# EAGLE design eTapper1main25 (EAGLE 8.2.2)
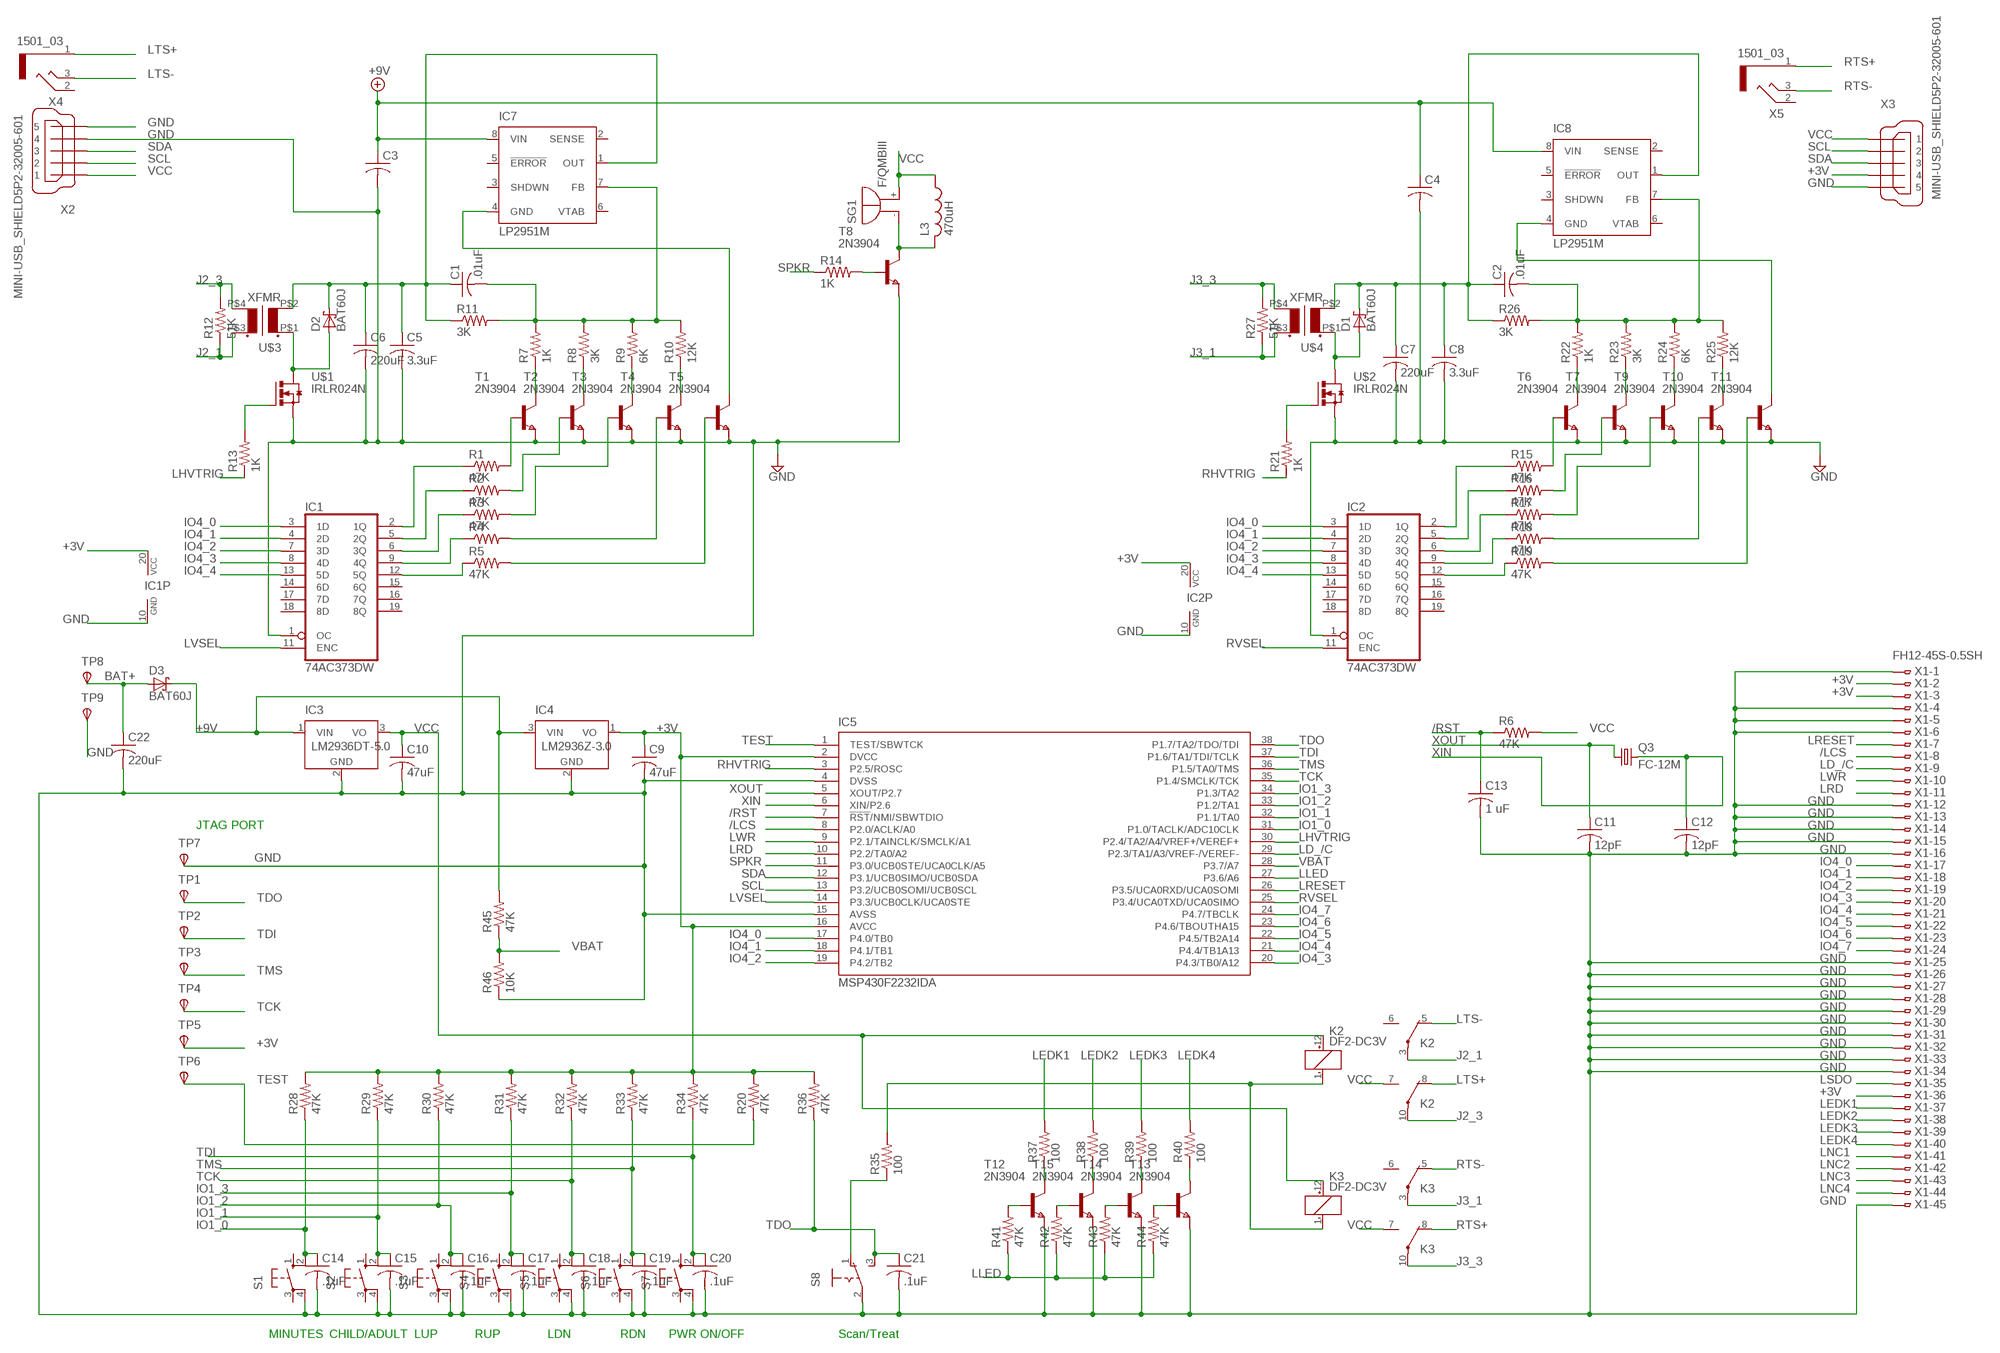
[diagram p0: schematic, sheet 1]

## Parts
C1  .01uF  C-USC0805  [C0805]
C2  .01uF  C-USC0805  [C0805]
C3  C-USC0805  [C0805]
C4  C-USC0805  [C0805]
C5  3.3uF  C-USC0805  [C0805]
C6  220uF  C-USC0805  [C0805]
C7  220uF  C-USC0805  [C0805]
C8  3.3uF  C-USC0805  [C0805]
C9  47uF  C-USC0805  [C0805]
C10  47uF  C-USC0805  [C0805]
C11  12pF  C-USC0805  [C0805]
C12  12pF  C-USC0805  [C0805]
C13  1 uF  C-USC0805  [C0805]
C14  .1uF  C-USC0805  [C0805]
C15  .1uF  C-USC0805  [C0805]
C16  .1uF  C-USC0805  [C0805]
C17  .1uF  C-USC0805  [C0805]
C18  .1uF  C-USC0805  [C0805]
C19  .1uF  C-USC0805  [C0805]
C20  .1uF  C-USC0805  [C0805]
C21  .1uF  C-USC0805  [C0805]
C22  220uF  C-USC0805  [C0805]
D1  BAT60J  [SOD323_ST]
D2  BAT60J  [SOD323_ST]
D3  BAT60J  [SOD323_ST]
IC1  74AC373DW  [SO20W]
IC2  74AC373DW  [SO20W]
IC3  LM2936DT-5.0  [TO252]
IC4  LM2936Z-3.0  [TO92]
IC5  MSP430F2232IDA  [TSSOP38_R-PDSO-G38-DA]
IC7  LP2951M  [SO08]
IC8  LP2951M  [SO08]
K2  DF2-DC3V  [DF2]
K3  DF2-DC3V  [DF2]
L3  470uH  L-USL2825P  [L2825P]
Q3  FC-12M  [FC-12M]
R1  47K  R-US_R0402  [R0402]
R2  47K  R-US_R0402  [R0402]
R3  47K  R-US_R0402  [R0402]
R4  R-US_R0402  [R0402]
R5  47K  R-US_R0402  [R0402]
R6  47K  R-US_R0402  [R0402]
R7  1K  R-US_R0402  [R0402]
R8  3K  R-US_R0402  [R0402]
R9  6K  R-US_R0402  [R0402]
R10  12K  R-US_R0402  [R0402]
R11  3K  R-US_R0402  [R0402]
R12  51K  R-US_R0402  [R0402]
R13  1K  R-US_R0402  [R0402]
R14  1K  R-US_R0402  [R0402]
R15  47K  R-US_R0402  [R0402]
R16  47K  R-US_R0402  [R0402]
R17  47K  R-US_R0402  [R0402]
R18  47K  R-US_R0402  [R0402]
R19  47K  R-US_R0402  [R0402]
R20  47K  R-US_R0402  [R0402]
R21  1K  R-US_R0402  [R0402]
R22  1K  R-US_R0402  [R0402]
R23  3K  R-US_R0402  [R0402]
R24  6K  R-US_R0402  [R0402]
R25  12K  R-US_R0402  [R0402]
R26  3K  R-US_R0402  [R0402]
R27  51K  R-US_R0402  [R0402]
R28  47K  R-US_R0402  [R0402]
R29  47K  R-US_R0402  [R0402]
R30  47K  R-US_R0402  [R0402]
R31  47K  R-US_R0402  [R0402]
R32  47K  R-US_R0402  [R0402]
R33  47K  R-US_R0402  [R0402]
R34  47K  R-US_R0402  [R0402]
R35  100  R-US_R0402  [R0402]
R36  47K  R-US_R0402  [R0402]
R37  100  R-US_R0402  [R0402]
R38  100  R-US_R0402  [R0402]
R39  100  R-US_R0402  [R0402]
R40  100  R-US_R0402  [R0402]
R41  47K  R-US_R0402  [R0402]
R42  47K  R-US_R0402  [R0402]
R43  47K  R-US_R0402  [R0402]
R44  47K  R-US_R0402  [R0402]
R45  47K  R-US_R0402  [R0402]
R46  10K  R-US_R0402  [R0402]
S1  10-XX  [B3F-10XX]
S2  10-XX  [B3F-10XX]
S3  10-XX  [B3F-10XX]
S4  10-XX  [B3F-10XX]
S5  10-XX  [B3F-10XX]
S6  10-XX  [B3F-10XX]
S7  10-XX  [B3F-10XX]
S8  M251  [M251]
SG1  F/QMBIII  [F/QMBIII]
T1  2N3904  NPNSOT23  [SOT-23]
T2  2N3904  NPNSOT23  [SOT-23]
T3  2N3904  NPNSOT23  [SOT-23]
T4  2N3904  NPNSOT23  [SOT-23]
T5  2N3904  NPNSOT23  [SOT-23]
T6  2N3904  NPNSOT23  [SOT-23]
T7  2N3904  NPNSOT23  [SOT-23]
T8  2N3904  NPNSOT23  [SOT-23]
T9  2N3904  NPNSOT23  [SOT-23]
T10  2N3904  NPNSOT23  [SOT-23]
T11  2N3904  NPNSOT23  [SOT-23]
T12  2N3904  NPNSOT23  [SOT-23]
T13  2N3904  NPNSOT23  [SOT-23]
T14  2N3904  NPNSOT23  [SOT-23]
T15  2N3904  NPNSOT23  [SOT-23]
TP1  TPSTP06R  [TP06R]
TP2  TPSTP06R  [TP06R]
TP3  TPSTP06R  [TP06R]
TP4  TPSTP06R  [TP06R]
TP5  TPSTP06R  [TP06R]
TP6  TPSTP06R  [TP06R]
TP7  TPSTP06R  [TP06R]
TP8  TPSTP06R  [TP06R]
TP9  TPSTP06R  [TP06R]
U$1  IRLR024N  [D-PAK_TO252AA]
U$2  IRLR024N  [D-PAK_TO252AA]
U$3  XFMR  [XFMR]
U$4  XFMR  [XFMR]
X1  FH12-45S-0.5SH  [FH12-45S-0.5SH]
X2  MINI-USB_SHIELD5P2-32005-601  [32005-601]
X3  MINI-USB_SHIELD5P2-32005-601  [32005-601]
X4  1501_03  [1501_03]
X5  1501_03  [1501_03]

## Nets
+3V: C9.1 IC1.20(VCC) IC2.20(VCC) IC4.1(VO) IC5.2(DVCC) IC5.16(AVCC) R20.2 R28.2 R29.2 R30.2 R31.2 R32.2 R33.2 R34.2 R36.2 TP5.TP(PP) X1.2 X1.3 X1.36 X3.4
+9V: C3.1 C4.1 D3.C IC3.1(VIN) IC4.3(VIN) IC7.8(VIN) IC8.8(VIN) R45.2
/LCS: IC5.8(P2.0/ACLK/A0) X1.8
/RST: C13.1 IC5.7(!RST!/NMI/SBWTDIO) R6.1
BAT+: C22.1 D3.A TP8.TP(PP)
GND: C3.2 C4.2 C5.2 C6.2 C7.2 C8.2 C9.2 C10.2 C11.2 C12.2 C13.2 C14.2 C15.2 C16.2 C17.2 C18.2 C19.2 C20.2 C21.2 C22.2 IC1.1(OC) IC1.10(GND) IC2.1(OC) IC2.10(GND) IC3.2(GND) IC4.2(GND) IC5.4(DVSS) IC5.15(AVSS) R46.1 S1.4(P1) S2.4(P1) S3.4(P1) S4.4(P1) S5.4(P1) S6.4(P1) S7.4(P1) S8.2(P) T1.2(E) T2.2(E) T3.2(E) T4.2(E) T5.2(E) T6.2(E) T7.2(E) T8.2(E) T9.2(E) T10.2(E) T11.2(E) T12.2(E) T13.2(E) T14.2(E) T15.2(E) TP7.TP(PP) TP9.TP(PP) U$1.3(S) U$2.3(S) X1.1 X1.4 X1.5 X1.6 X1.12 X1.13 X1.14 X1.15 X1.16 X1.25 X1.26 X1.27 X1.28 X1.29 X1.30 X1.31 X1.32 X1.33 X1.34 X1.45 X2.4 X2.5 X3.5
IO1_0: C14.1 IC5.31(P1.0/TACLK/ADC10CLK) R28.1 S1.2(S1)
IO1_1: C15.1 IC5.32(P1.1/TA0) R29.1 S2.2(S1)
IO1_2: C16.1 IC5.33(P1.2/TA1) R30.1 S3.2(S1)
IO1_3: C17.1 IC5.34(P1.3/TA2) R31.1 S4.2(S1)
IO4_0: IC1.3(1D) IC2.3(1D) IC5.17(P4.0/TB0) X1.17
IO4_1: IC1.4(2D) IC2.4(2D) IC5.18(P4.1/TB1) X1.18
IO4_2: IC1.7(3D) IC2.7(3D) IC5.19(P4.2/TB2) X1.19
IO4_3: IC1.8(4D) IC2.8(4D) IC5.20(P4.3/TB0/A12) X1.20
IO4_4: IC1.13(5D) IC2.13(5D) IC5.21(P4.4/TB1A13) X1.21
IO4_5: IC5.22(P4.5/TB2A14) X1.22
IO4_6: IC5.23(P4.6/TBOUTHA15) X1.23
IO4_7: IC5.24(P4.7/TBCLK) X1.24
J2_1: K2.3(2:P) R12.1 U$3.P$3(S1)
J2_3: K2.10(3:P) R12.2 U$3.P$4(S2)
J3_1: K3.3(2:P) R27.1 U$4.P$3(S1)
J3_3: K3.10(3:P) R27.2 U$4.P$4(S2)
LD_/C: IC5.29(P2.3/TA1/A3/VREF-/VEREF-) X1.9
LEDK1: R37.2 X1.37
LEDK2: R38.2 X1.38
LEDK3: R39.2 X1.39
LEDK4: R40.2 X1.40
LHVTRIG: IC5.30(P2.4/TA2/A4/VREF+/VEREF+) R13.1
LLED: IC5.27(P3.6/A6) R41.1 R42.1 R43.1 R44.1
LNC1: X1.41
LNC2: X1.42
LNC3: X1.43
LNC4: X1.44
LRD: IC5.10(P2.2/TA0/A2) X1.11
LRESET: IC5.26(P3.5/UCA0RXD/UCA0SOMI) X1.7
LSDO: X1.35
LTS+: K2.8(3:O) X4.1
LTS-: K2.5(2:O) X4.3
LVSEL: IC1.11(ENC) IC5.14(P3.3/UCB0CLK/UCA0STE)
LWR: IC5.9(P2.1/TAINCLK/SMCLK/A1) X1.10
N$1: IC1.2(1Q) R1.1
N$2: IC1.5(2Q) R2.1
N$3: IC1.6(3Q) R3.1
N$4: IC1.9(4Q) R4.1
N$5: IC1.12(5Q) R5.1
N$6: L3.2 SG1.-(+) T8.1(C)
N$7: R4.2 T4.3(B)
N$8: R5.2 T5.3(B)
N$9: D2.A U$1.4(D) U$3.P$1(P1)
N$10: R7.1 T1.1(C)
N$11: R8.1 T2.1(C)
N$12: R9.1 T3.1(C)
N$13: R1.2 T1.3(B)
N$14: R2.2 T2.3(B)
N$15: R3.2 T3.3(B)
N$16: R10.1 T4.1(C)
N$17: C1.2 IC7.7(FB) R7.2 R8.2 R9.2 R10.2 R11.2
N$18: C1.1 C5.1 C6.1 D2.C IC7.1(OUT) R11.1 U$3.P$2(P2)
N$19: D1.A U$2.4(D) U$4.P$1(P1)
N$20: IC2.2(1Q) R15.1
N$21: R13.2 U$1.1(G)
N$22: R14.2 T8.3(B)
N$23: R35.1 S8.1(O)
N$24: IC2.5(2Q) R16.1
N$25: IC2.6(3Q) R17.1
N$26: IC2.9(4Q) R18.1
N$27: IC2.12(5Q) R19.1
N$28: R44.2 T13.3(B)
N$29: R15.2 T6.3(B)
N$30: R16.2 T7.3(B)
N$31: R17.2 T9.3(B)
N$32: R18.2 T10.3(B)
N$33: R19.2 T11.3(B)
N$34: K2.1(1:-) K3.1(1:-) R35.2
N$35: R22.1 T6.1(C)
N$36: R23.1 T7.1(C)
N$37: R24.1 T9.1(C)
N$38: R25.1 T10.1(C)
N$39: C2.2 IC8.7(FB) R22.2 R23.2 R24.2 R25.2 R26.2
N$40: C2.1 C7.1 C8.1 D1.C IC8.1(OUT) R26.1 U$4.P$2(P2)
N$41: R37.1 T12.1(C)
N$42: R21.2 U$2.1(G)
N$43: R38.1 T15.1(C)
N$44: R39.1 T14.1(C)
N$45: IC7.4(GND) T5.1(C)
N$46: R40.1 T13.1(C)
N$47: IC8.4(GND) T11.1(C)
N$48: R43.2 T14.3(B)
N$49: R41.2 T12.3(B)
N$50: R42.2 T15.3(B)
RHVTRIG: IC5.3(P2.5/ROSC) R21.1
RTS+: K3.8(3:O) X5.1
RTS-: K3.5(2:O) X5.3
RVSEL: IC2.11(ENC) IC5.25(P3.4/UCA0TXD/UCA0SIMO)
SCL: IC5.13(P3.2/UCB0SOMI/UCB0SCL) X2.2 X3.2
SDA: IC5.12(P3.1/UCB0SIMO/UCB0SDA) X2.3 X3.3
SPKR: IC5.11(P3.0/UCB0STE/UCA0CLK/A5) R14.1
TCK: C18.1 IC5.35(P1.4/SMCLK/TCK) R32.1 S5.2(S1) TP4.TP(PP)
TDI: C20.1 IC5.37(P1.6/TA1/TDI/TCLK) R34.1 S7.2(S1) TP2.TP(PP)
TDO: C21.1 IC5.38(P1.7/TA2/TDO/TDI) R36.1 S8.3(S) TP1.TP(PP)
TEST: IC5.1(TEST/SBWTCK) R20.1 TP6.TP(PP)
TMS: C19.1 IC5.36(P1.5/TA0/TMS) R33.1 S6.2(S1) TP3.TP(PP)
VBAT: IC5.28(P3.7/A7) R45.1 R46.2
VCC: C10.1 IC3.3(VO) K2.7(3:S) K2.12(1:+) K3.7(3:S) K3.12(1:+) L3.1 R6.2 SG1.+(-) X2.1 X3.1
XIN: C12.1 IC5.6(XIN/P2.6) Q3.2
XOUT: C11.1 IC5.5(XOUT/P2.7) Q3.1
Unconnected: IC1.14(6D) IC1.15(6Q) IC1.16(7Q) IC1.17(7D) IC1.18(8D) IC1.19(8Q) IC2.14(6D) IC2.15(6Q) IC2.16(7Q) IC2.17(7D) IC2.18(8D) IC2.19(8Q) IC7.2(SENSE) IC7.3(SHDWN) IC7.5(!ERROR) IC7.6(VTAB) IC8.2(SENSE) IC8.3(SHDWN) IC8.5(!ERROR) IC8.6(VTAB) K2.6(2:S) K3.6(2:S) S1.1(S) S1.3(P) S2.1(S) S2.3(P) S3.1(S) S3.3(P) S4.1(S) S4.3(P) S5.1(S) S5.3(P) S6.1(S) S6.3(P) S7.1(S) S7.3(P) X2.M1(S1) X2.M2(S2) X3.M1(S1) X3.M2(S2) X4.2 X5.2

## Notes on the sheet
- JTAG PORT
- MINUTES | CHILD/ADULT | LUP | RUP | LDN | RDN | PWR ON/OFF | Scan/Treat

## Library data of the parts
C1-C22 = rcl:C-US: CAPACITOR, American symbol
D1-D3 = diode:BAT60J: Schottky barrier diode Source: www.st.com, BAT60J.pdf
IC1 IC2 = 74xx-eu:74*373: Octal D type transparent LATCH, edge triggered
IC3 = national-semiconductor:LM2936?*: Ultra-Low Quiescent Current LDO Voltage Regulator Source: Data sheet <http://www.national.com/ds/LM/LM2936.pdf>; MF: NATIONAL SEMICONDUCTOR; MPN: LM2936DT-5.0/NOPB; OC_FARNELL: 1286864; OC_NEWARK: 41K4501
IC4 = national-semiconductor:LM2936?*: Ultra-Low Quiescent Current LDO Voltage Regulator Source: Data sheet <http://www.national.com/ds/LM/LM2936.pdf>; MF: NATIONAL SEMICONDUCTOR; MPN: LM2936Z-3.0/NOPB; OC_FARNELL: 1312709; OC_NEWARK: 41K4531
IC5 = texas:MSP430F22*2IDA: MIXED SIGNAL MICROCONTROLLER Source: http://focus.ti.com/lit/ds/symlink/msp430f2274.pdf; MPN: MSP430F2232IDA; OC_FARNELL: 1610178; OC_NEWARK: 28M6312
IC7 IC8 = national-semiconductor:LP2951: Adjustable Micropower Voltage Regulator Source: http://www.national.com/ds/LP/LP2950.pdf; MF: FAIRCHILD SEMICONDUCTOR; MPN: LP2951CM; OC_FARNELL: 9488561; OC_NEWARK: 78K6014
K2 K3 = relay:DF2-?DC*: HIGHLY SENSITIVE DIP MINIATURE RELAY NAiS Single side stable / 1 coil latching Source: http://www.mew-europe.com/.. en_ds_61002_0000.pdf; OC_FARNELL: unknown; OC_NEWARK: unknown
L3 = rcl:L-US: INDUCTOR, American symbol
Q3 = crystal:FC-12M: kHz RANGE CRYSTAL UNIT LOW PROFILE SMD Source: Epson Toyocom FC-12M.pdf
R1-R46 = resistor:R-US_: RESISTOR, American symbol
S1-S7 = switch-omron:10-XX: OMRON SWITCH; MPN: B3F-1000; OC_FARNELL: 176432; OC_NEWARK: 36M3542
S8 = switch:M251: SLIDING SWITCH Mors, distributor Buerklin, 11G702
SG1 = buzzer:F/QMBIII: BUZZER Source: Buerklin; OC_FARNELL: unknown; OC_NEWARK: unknown
T1-T15 = zetex:NPNSOT23: NPN TRANSISTOR; MPN: DSS20201L-7; OC_FARNELL: 1710688; OC_NEWARK: 25R4555
TP1-TP9 = testpad:TPS: TEST PIN
U$1 U$2 = IRLR024N:IRLR024N: IRLR024N HEXFET Power Mosfet N channel Infeneon Technology TO-251AA IPAK
U$3 U$4 = XFMR:XFMR: Transformer 1"X1" 0.4"X0.4" hole separation for e_tapper
X1 = con-hirose:FH12-45S-0.5S: 0.5mm Pitch Connectors For FPC/FFC Source: Data sheet <http://www.hirose.co.jp/cataloge_hp/e58605370.pdf>; OC_FARNELL: unknown; OC_NEWARK: unknown
X2 X3 = con-cypressindustries:MINI-USB_SHIELD5P2-: MINI USB-B R/A DIP 5pol. Source: www.cypressindustries.com; OC_FARNELL: unknown; OC_NEWARK: unknown
X4 X5 = con-lumberg:1501_03: Klinkensteckverbinder nach JISC 6560, 2,5 mm Jack connectors according to JISC 6560, 2.5 mm Source: http://www.lumberg.com/Produkte/PDFs/1501_03.pdf; OC_FARNELL: 1200127; OC_NEWARK: unknown

## Module LP2951
Ports: 

### Library data of the parts

## Board
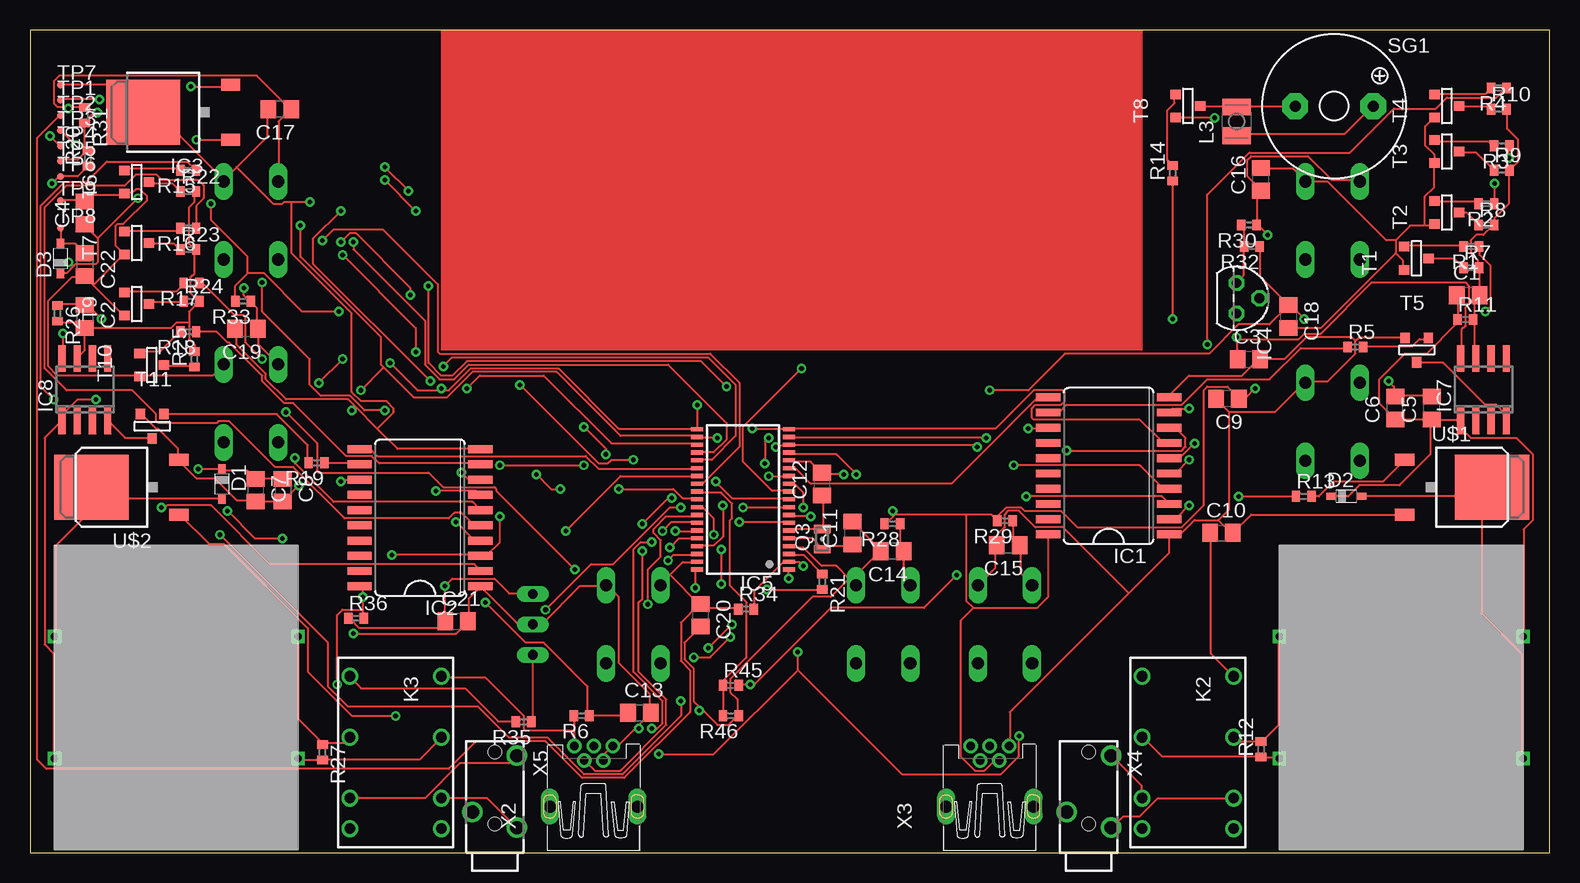
[diagram p1: board, top side]
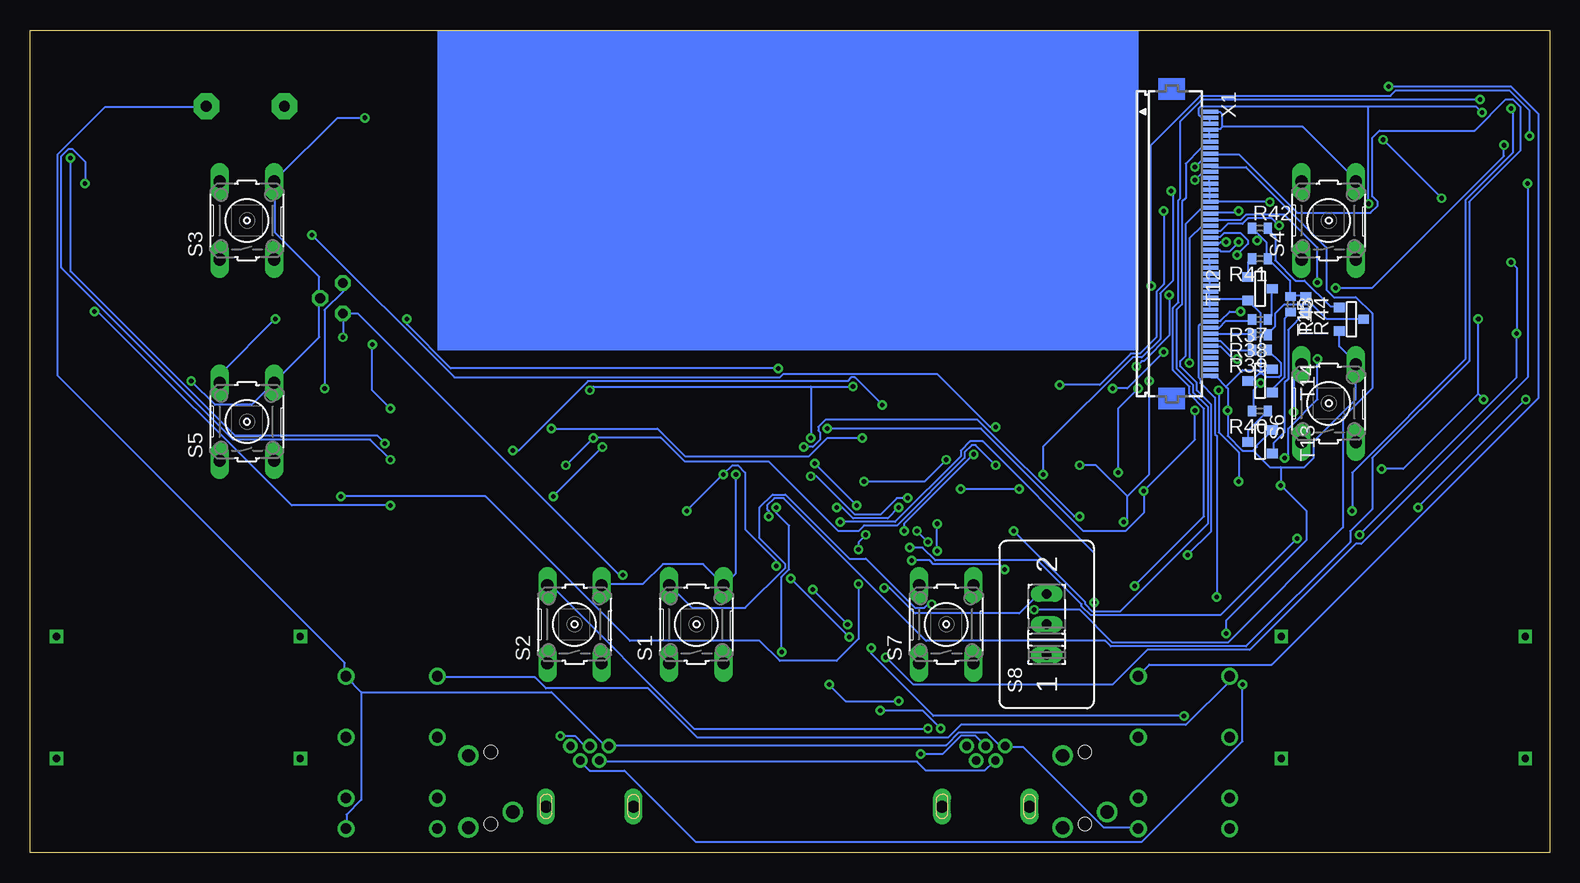
[diagram p2: board, bottom side, seen from below]

Size 126.67 x 68.57 mm. Coordinates in mm from the lower left corner, seen from the top.
Outline: 0,0 126.67,0 126.67,68.57 0,68.57 0,0
Copper layers (1*16): Top 0.035mm / dielectric 1.5mm / Bottom 0.035mm
Design rules "default *": minimum track width 6mil, minimum drill 15mil, track to track 6mil, track to pad 6mil, pad to pad 6mil, via to via 6mil, smd to smd 6mil, copper to edge 10mil, drill to drill 10mil, minimum pad ring 10mil, minimum via ring 8mil, stop-mask expansion 4mil, vias tented up to drill 0mil, thermal gap 15mil

### Footprints (pad centres in the part's own frame; a part is rotated, then mirrored left to right if it is on the bottom)
C0805 = smd 1.3 x 1.5: 1 -0.95,0; 2 0.95,0
SOD323_ST = smd 0.8 x 0.6: A 1.25,0; C -1.25,0
SO20W = smd 0.66 x 2.032: 1 -5.715,-5.029; 2 -4.445,-5.029; 3 -3.175,-5.029; 4 -1.905,-5.029; 5 -0.635,-5.029; 6 0.635,-5.029; 7 1.905,-5.029; 8 3.175,-5.029; 9 4.445,-5.029; 10 5.715,-5.029; 11 5.715,5.029; 12 4.445,5.029; 13 3.175,5.029; 14 1.905,5.029; 15 0.635,5.029; 16 -0.635,5.029; 17 -1.905,5.029; 18 -3.175,5.029; 19 -4.445,5.029; 20 -5.715,5.029
TO252 = smd 1 x 1.6: 1 -2.28,-4.8; 3 2.28,-4.8 | smd 5.4 x 6.2: 2 0,2.5
TO92 = drill 0.813 pad 1.27 octagon: 1 -1.27,0; 2 0,1.905; 3 1.27,0
TSSOP38_R-PDSO-G38-DA = smd 0.35 x 1: 1 -5.85,-3.85; 2 -5.2,-3.85; 3 -4.55,-3.85; 4 -3.9,-3.85; 5 -3.25,-3.85; 6 -2.6,-3.85; 7 -1.95,-3.85; 8 -1.3,-3.85; 9 -0.65,-3.85; 10 0,-3.85; 11 0.65,-3.85; 12 1.3,-3.85; 13 1.95,-3.85; 14 2.6,-3.85; 15 3.25,-3.85; 16 3.9,-3.85; 17 4.55,-3.85; 18 5.2,-3.85; 19 5.85,-3.85; 20 5.85,3.85; 21 5.2,3.85; 22 4.55,3.85; 23 3.9,3.85; 24 3.25,3.85; 25 2.6,3.85; 26 1.95,3.85; 27 1.3,3.85; 28 0.65,3.85; 29 0,3.85; 30 -0.65,3.85; 31 -1.3,3.85; 32 -1.95,3.85; 33 -2.6,3.85; 34 -3.25,3.85; 35 -3.9,3.85; 36 -4.55,3.85; 37 -5.2,3.85; 38 -5.85,3.85
SO08 = smd 0.6 x 2.2: 1 -1.905,-2.6; 2 -0.635,-2.6; 3 0.635,-2.6; 4 1.905,-2.6; 5 1.905,2.6; 6 0.635,2.6; 7 -0.635,2.6; 8 -1.905,2.6
DF2 = drill 0.9: 1 -6.35,-3.81; 3 -1.27,-3.81; 5 3.81,-3.81; 6 6.35,-3.81; 7 6.35,3.81; 8 3.81,3.81; 10 -1.27,3.81; 12 -6.35,3.81
L2825P = smd 1.4 x 2.4: 1 -1.2,0; 2 1.2,0
FC-12M = smd 0.7 x 1.4: 1 -0.85,0; 2 0.85,0
R0402 = smd 0.7 x 0.9: 1 -0.65,0; 2 0.65,0
B3F-10XX = drill 1.016 long: 1 -3.251,2.261; 2 3.251,2.261; 3 -3.251,-2.261; 4 3.251,-2.261
M251 = drill 0.813 long: 1 -2.54,0; 2 0,0; 3 2.54,0
F/QMBIII = drill 0.914 pad 2.159 octagon: + 3.251,0; - -3.251,0
SOT-23 = smd 0.787 x 0.889: 1 0.025,-1.016; 2 -0.94,1.016; 3 0.991,1.016
TP06R = smd 0.6 x 0.6: TP 0,0
D-PAK_TO252AA = smd 1 x 1.6: 1 -2.28,-4.8; 3 2.28,-4.8 | smd 5.4 x 6.2: 4 0,2.5
XFMR = drill 0.6 square: P$1 -10.16,5.08; P$2 -10.16,-5.08; P$3 10.16,5.08; P$4 10.16,-5.08
FH12-45S-0.5SH = smd 0.3 x 1.3: 1 -13,3.25; 2 -12.5,3.25; 3 -12,3.25; 4 -11.5,3.25; 5 -11,3.25; 6 -10.5,3.25; 7 -10,3.25; 8 -9.5,3.25; 9 -9,3.25; 10 -8.5,3.25; 11 -8,3.25; 12 -7.5,3.25; 13 -7,3.25; 14 -6.5,3.25; 15 -6,3.25; 16 -5.5,3.25; 17 -5,3.25; 18 -4.5,3.25; 19 -4,3.25; 20 -3.5,3.25; 21 -3,3.25; 22 -2.5,3.25; 23 -2,3.25; 24 -1.5,3.25; 25 -1,3.25; 26 -0.5,3.25; 27 0,3.25; 28 0.5,3.25; 29 1,3.25; 30 1.5,3.25; 31 2,3.25; 32 2.5,3.25; 33 3,3.25; 34 3.5,3.25; 35 4,3.25; 36 4.5,3.25; 37 5,3.25; 38 5.5,3.25; 39 6,3.25; 40 6.5,3.25; 41 7,3.25; 42 7.5,3.25; 43 8,3.25; 44 8.5,3.25; 45 9,3.25
32005-601 = drill 0.7 pad 1.016: 1 2.825,1.6; 2 1.625,0.8; 3 2.825,0; 4 1.625,-0.8; 5 2.825,-1.6 | drill 1 pad 1.422 long: M1 -2.225,3.65; M2 -2.225,-3.65
1501_03 = drill 1.1 pad 1.7: 1 -1.85,0.3; 2 1.85,-1; 3 -1.85,-5.7 | hole 1.1: 0,0; 0,-6

### Placement (x,y rotation side)
C1  119.89,46.48 0 top
C2  4.57,44.7 270 top
C3  101.6,41.15 0 top
C4  4.57,53.34 90 top
C5  116.84,37.08 90 top
C6  113.79,37.08 90 top
C7  18.8,30.23 270 top
C8  21.08,30.23 270 top
C9  99.82,37.85 180 top
C10  99.31,26.67 0 top
C11  68.58,26.67 90 top
C12  66.04,30.73 90 top
C13  50.8,11.68 0 top
C14  71.88,25.15 180 top
C15  81.53,25.65 180 top
C16  102.62,56.13 90 top
C17  20.83,61.98 180 top
C18  104.9,44.7 270 top
C19  18.03,43.69 180 top
C20  55.88,19.81 270 top
C21  35.56,19.3 0 top
C22  4.57,49.02 270 top
D1  16,30.73 270 top
D2  109.73,29.72 0 top
D3  2.54,49.53 90 top
IC1  89.92,32.26 90 top
IC2  32.51,27.94 90 top
IC3  11.94,61.72 90 top
IC4  100.58,46.23 270 top
IC5  59.44,29.46 90 top
IC7  121.16,38.61 0 top
IC8  4.57,38.61 0 top
K2  96.52,8.38 270 top
K3  30.48,8.38 270 top
L3  100.58,60.96 90 top
Q3  66.04,26.16 90 top
R1  120.14,50.55 180 top
R2  121.41,54.1 180 top
R3  122.68,58.93 180 top
R4  122.43,63.75 180 top
R5  110.49,42.16 0 top
R6  45.97,11.43 180 top
R7  120.14,48.77 0 top
R8  121.41,52.32 0 top
R9  122.68,56.9 0 top
R10  122.43,61.98 0 top
R11  119.63,44.45 0 top
R12  102.62,8.64 90 top
R13  106.17,29.72 0 top
R14  95.25,56.64 90 top
R15  13.21,56.9 180 top
R16  13.21,52.07 180 top
R17  13.46,47.5 180 top
R18  13.21,43.43 180 top
R19  23.88,32.51 180 top
R20  4.83,57.91 90 top
R21  66.04,22.61 270 top
R22  13.21,55.12 0 top
R23  13.21,50.29 0 top
R24  13.46,45.97 0 top
R25  13.72,41.15 90 top
R26  2.29,44.96 270 top
R27  24.38,8.38 270 top
R28  71.88,27.43 180 top
R29  81.28,27.69 180 top
R30  101.6,52.32 180 top
R31  4.57,61.47 270 top
R32  101.85,50.55 180 top
R33  17.78,45.97 180 top
R34  59.69,20.32 0 top
R35  41.15,10.92 180 top
R36  27.18,19.56 0 top
R37  24.13,44.45 180 bottom
R38  24.13,43.18 180 bottom
R39  24.13,41.91 180 bottom
R40  24.13,36.83 180 bottom
R41  24.13,49.53 180 bottom
R42  24.13,52.07 0 bottom
R43  21.59,45.72 270 bottom
R44  20.32,45.72 270 bottom
R45  58.42,13.97 0 top
R46  58.42,11.43 180 top
S1  71.12,19.05 90 bottom
S2  81.28,19.05 90 bottom
S3  108.58,52.7 90 bottom
S4  18.41,52.7 90 bottom
S5  108.58,35.94 90 bottom
S6  18.41,37.47 90 bottom
S7  50.29,19.05 90 bottom
S8  41.91,19.05 90 bottom
SG1  108.71,62.23 0 top
T1  115.57,49.53 90 top
T2  118.11,53.34 90 top
T3  118.11,58.42 90 top
T4  118.11,62.23 90 top
T5  115.57,41.91 0 top
T6  8.89,55.88 90 top
T7  8.89,50.8 90 top
T8  96.52,62.23 90 top
T9  8.89,45.72 90 top
T10  10.16,40.64 90 top
T11  10.16,35.56 0 top
T12  24.13,46.99 90 bottom
T13  24.13,34.29 270 bottom
T14  24.13,39.37 270 bottom
T15  16.51,44.45 90 bottom
TP1  2.54,62.74 0 top
TP2  2.54,61.47 0 top
TP3  2.54,60.2 0 top
TP4  2.54,58.93 0 top
TP5  2.54,57.66 0 top
TP6  2.54,56.39 0 top
TP7  2.54,64.01 0 top
TP8  2.54,52.07 0 top
TP9  2.54,54.36 0 top
U$1  119.38,30.48 270 top
U$2  7.62,30.48 90 top
U$3  114.3,12.95 180 top
U$4  12.19,12.95 0 top
X1  31.5,48.77 270 bottom
X2  46.99,6.1 90 top
X3  80.01,6.1 90 top
X4  88.27,2.41 180 top
X5  38.73,2.41 180 top

### Tracks (layer width: path | path; a pad name or v marks a point on that pad's centre or on a via)
+3V  (via drill 0.38)
  Top 0.152: TP5.TP 2.59,57.76 3.96,57.76 4.72,58.52 R20.2 4.72,58.67 4.57,58.83 R31.2 4.57,60.96 5.33,61.72 v5.64,61.72 | 27.74,20.27 v27.74,21.34 27.74,21.95 27.58,22.1 IC2.20 | 27.74,20.27 27.74,19.66 R36.2 | 18.14,48.31 17.07,47.24 17.07,46.02 R33.2 | 18.14,48.31 19.51,48.31 22.71,45.11 v25.76,45.11 | v15.09,54.1 15.09,52.73 18.14,49.68 18.14,48.31 | R30.2 101.04,52.27 101.19,52.12 101.19,50.6 R32.2 101.19,50.44 101.19,48.16 100.58,47.55 IC4.1 | v102.11,38.71 101.35,37.95 100.89,37.95 C9.1 100.74,37.95 99.82,38.86 98.15,38.86 97.84,38.56 97.84,28.96 96.01,27.13 87.33,27.13 85.95,28.5 82.91,28.5 82.6,28.8 81.38,28.8 80.47,27.89 | R34.2 60.35,20.42 60.35,21.79 62.79,24.23 63.25,24.23 IC5.2 63.4,24.23 64.16,24.23 v64.47,23.93 | 78.03,28.19 80.16,28.19 80.47,27.89 | 78.03,28.19 72.24,28.19 | 72.24,28.19 72.08,28.19 71.32,27.43 R28.2 | 80.47,27.89 80.62,27.74 R29.2 80.47,27.89 | v68.89,31.55 67.21,33.22 63.4,33.22 IC5.16 | 72.24,28.19 v71.93,28.5 | IC1.20 84.89,21.34 83.97,20.42 78.64,20.42 | 78.64,20.42 78.03,21.03 78.03,28.19 | 78.64,20.42 77.57,19.36 77.57,8.08 78.79,6.86 79.55,6.86 80.31,7.62 80.77,7.62 X3.4 | 27.74,20.27 26.06,20.27 25.6,19.81 v25.6,14.02
  Bottom 0.152: 28.35,61.27 28.35,60.81 X1.3 | 28.35,61.27 28.96,61.27 29.26,61.57 29.26,62.03 29.11,62.18 15.09,62.18 | 15.09,62.18 6.1,62.18 v5.64,61.72 | 28.35,61.27 X1.2 | v25.76,45.11 26.67,45.11 27.43,44.35 28.19,44.35 X1.36 28.35,44.2 28.96,44.2 29.26,43.89 29.26,39.62 29.11,39.47 29.11,39.17 27.89,37.95 27.89,34.9 27.74,34.75 v27.74,21.34 | v15.09,54.1 15.09,62.18 | v102.11,38.71 102.11,45.26 100.58,46.79 IC4.1 | v71.93,28.5 v68.89,31.55 68.12,32.31 67.67,32.31 67.06,31.7 67.06,26.98 64.47,24.38 v64.47,23.93 | v25.6,14.02 25.6,9.3 33.98,0.91 71.17,0.91 77.11,6.86 80.01,6.86 80.77,7.62 X3.4
+9V  (via drill 0.38)
  Top 0.152: 3.66,48.92 3.81,49.07 5.49,49.07 5.64,49.23 5.64,51.21 | 3.66,48.92 3.05,48.31 2.59,48.31 D3.C | 5.64,51.21 4.57,52.27 C4.1 | v13.87,59.44 16.61,59.44 IC3.1 | 5.64,51.21 v8.99,54.56 | v2.74,43.28 2.74,41.3 IC8.8 | v3.2,49.23 3.5,48.92 3.66,48.92 | v77.27,23.16 74.52,20.42 66.75,20.42 60.35,14.02 v60.05,14.02 59.13,14.02 R45.2 | 100.58,42.82 100.58,41.15 C3.1 | 100.58,42.82 105.77,42.82 106.22,43.28 107.59,43.28 111.86,47.55 119.63,47.55 119.94,47.24 119.94,45.72 119.63,45.41 119.63,43.89 119.33,43.59 119.33,41.3 IC7.8 | 100.58,42.82 v100.58,42.98 | v15.85,26.52 24.84,17.53 24.84,13.87 26.52,12.19 37.34,12.19 39.93,9.6 43.13,9.6 46.18,6.55 49.38,6.55 54.25,11.43 v54.25,12.65
  Bottom 0.152: v8.99,54.56 v13.87,59.44 | v3.2,49.23 2.74,48.77 v2.74,43.28 2.74,39.62 v15.85,26.52 | v77.27,23.16 77.57,23.16 99.36,44.96 IC4.3 v100.58,42.98 | v54.25,12.65 58.67,12.65 v60.05,14.02
/LCS  (via drill 0.38)
  Top 0.152: v65.08,28.04 63.4,28.04 IC5.8
  Bottom 0.152: v65.08,28.04 65.08,28.5 65.23,28.65 65.23,28.96 64.62,29.57 63.86,29.57 51.97,17.68 37.03,17.68 36.58,17.22 25.3,17.22 16.61,25.91 16.61,26.82 14.78,28.65 14.78,32.92 6.71,41 6.71,54.25 2.44,58.52 2.44,62.18 3.05,62.79 3.66,62.79 6.25,60.2 14.17,60.2 14.78,59.59 14.78,54.71 14.33,54.25 14.33,53.95 14.94,53.34 21.03,53.34 25.91,58.22 28.19,58.22 X1.8
/RST  (via drill 0.38)
  Top 0.152: C13.1 49.84,11.58 49.68,11.43 R6.1 46.48,11.43 46.48,13.87 42.82,17.53 41.3,17.53 v37.95,20.88 | v59.13,27.58 63.25,27.58 IC5.7
  Bottom 0.152: v59.13,27.58 54.56,27.58 49.07,33.07 49.07,33.53 48.31,34.29 47.24,34.29 37.95,24.99 v37.95,20.88
BAT+
  Top 0.152: TP8.TP 2.59,51.97 2.59,50.9 D3.A 2.59,50.75 3.81,50.75 4.57,49.99 C22.1
GND  (via drill 0.38)
  Top 0.152: TP7.TP 7.01,64.01 9.3,61.72 IC3.2 10.52,61.72 16.15,56.08 | 16.15,56.08 17.22,57.15 | 17.22,57.15 19.81,59.74 19.81,61.87 C17.2 | 21.79,54.25 21.18,54.25 21.03,54.1 20.27,54.1 17.22,57.15 | 21.79,54.25 v23.32,54.25 | 16.15,56.08 S4.4 | 50.6,10.52 49.07,8.99 48.62,8.99 X2.5 48.46,8.84 47.85,8.23 47.85,7.77 X2.4 | 50.6,10.52 51.66,11.58 C13.2 51.66,11.73 51.66,13.26 49.07,15.85 49.07,21.34 48.16,22.25 S7.4 48.01,22.25 45.87,22.25 42.67,19.05 S8.2 40.69,19.05 37.64,22.1 IC2.1 37.49,22.1 36.58,21.18 36.58,19.36 C21.2 36.42,19.2 35.51,18.29 v26.98,18.29 | 28.96,35.36 30.63,33.68 37.49,33.68 IC2.10 | 28.96,35.36 27.13,37.19 | 27.13,37.19 26.52,37.8 21.34,37.8 19.66,39.47 19.66,39.93 17.22,42.37 17.22,43.59 C19.2 | T11.2 9.3,36.58 10.52,35.36 10.67,35.36 12.34,33.68 12.34,32.77 U$2.3 12.5,32.61 13.87,31.24 15.39,31.24 17.22,29.41 18.75,29.41 C7.2 18.9,29.26 21.03,29.26 C8.2 21.18,29.41 v22.4,30.63 | 4.57,54.41 2.59,54.41 TP9.TP | 4.57,54.41 5.03,54.86 7.77,54.86 T6.2 7.92,55.02 8.53,55.02 8.84,55.32 9.14,55.32 9.75,54.71 9.75,54.41 7.77,52.43 7.32,52.43 7.16,52.27 7.16,50.6 7.77,49.99 T7.2 7.77,49.84 5.33,47.4 5.18,47.4 | 4.57,54.41 C4.2 | 4.57,48.01 5.18,47.4 | 5.18,47.4 7.77,44.81 T9.2 | 9.14,39.78 15.24,39.78 16.15,40.69 S6.4 | 4.57,48.01 3.5,48.01 1.52,46.02 1.52,40.54 2.29,39.78 9.14,39.78 | 4.57,48.01 C22.2 | 9.14,39.78 T10.2 | v26.82,36.88 27.13,37.19 | 21.79,54.25 21.79,49.99 26.82,44.96 26.82,38.41 27.58,37.64 29.72,37.64 30.33,37.03 30.33,36.73 28.96,35.36 | 58.98,11.43 58.22,10.67 57.3,10.67 55.93,12.04 | 55.93,12.04 55.32,12.65 55.32,15.39 54.56,16.15 54.56,17.53 55.78,18.75 C20.2
  Top 0.152: S2.4 79.1,22.4 80.47,23.77 80.47,25.6 C15.2 80.62,25.76 80.62,26.52 81.23,27.13 81.23,28.19 81.53,28.5 82.45,28.5 83.82,27.13 86.11,27.13 91.59,21.64 | IC5.15 63.4,32.61 65.08,32.61 65.99,31.7 C12.2 66.14,31.55 v67.82,31.55 | 68.43,22.71 68.73,22.4 S1.4 | 68.43,22.71 68.28,22.86 | 68.28,22.86 67.21,23.93 65.99,23.93 64.47,25.45 63.4,25.45 IC5.4 | 68.43,22.71 70.87,25.15 C14.2 71.02,25.15 68.58,27.58 C11.2 | 68.43,22.71 S1.4 | 58.98,11.43 58.98,12.8 58.37,13.41 58.37,14.48 65.23,21.34 66.75,21.34 68.28,22.86 | 58.98,11.43 R46.1 | 68.28,22.86 S1.4 | v98.75,61.27 95.56,61.27 T8.2 | C16.2 102.72,57 105.31,57 106.22,56.08 S3.4 106.38,55.93 108.2,55.93 113.08,51.05 113.84,51.05 | T4.2 117.04,61.27 116.28,60.5 116.28,58.98 117.04,58.22 117.04,57.61 T3.2 117.04,57.45 117.04,55.47 116.28,54.71 116.28,52.27 | 113.84,49.99 114.45,49.38 114.45,48.62 T1.2 | 113.84,51.05 113.84,49.99 | 113.84,51.05 115.06,52.27 116.28,52.27 | 116.28,52.27 117.04,52.27 T2.2 | 113.84,49.99 107.59,43.74 105,43.74 C18.2 | IC1.10 94.94,38.1 96.62,39.78 101.04,39.78 102.41,41.15 C3.2 104.55,41.15 106.38,42.98 110.19,42.98 110.49,42.67 | C5.2 116.74,38.1 113.84,38.1 C6.2 113.69,38.1 113.69,38.86 v113.23,39.32 | 110.49,42.67 110.8,42.98 114.61,42.98 T5.2 | 110.49,42.67 110.49,41.6 108.2,39.32 106.38,39.32 S5.4 106.22,39.17 103.78,36.73 99.97,36.73 | 99.97,36.73 98.91,37.8 C9.2 | 99.06,27.74 100.13,26.67 C10.2 100.28,26.67 101.8,28.19 114.45,28.19 U$1.3 | 99.06,27.74 97.08,27.74 96.01,26.67 94.94,26.67 IC1.1 94.94,24.99 91.59,21.64 | 91.59,21.64 81.69,11.73 81.69,8.99 X3.5 | 99.97,36.73 99.97,28.65 99.06,27.74
  Top 0.152: v50.75,10.36 50.6,10.52 | 55.93,12.04 v55.78,11.89
  Bottom 0.152: X1.6 28.35,59.28 28.35,59.74 X1.5 28.35,59.89 28.35,60.2 X1.4 28.19,60.35 27.43,60.35 27.28,60.5 | 27.28,60.5 27.28,61.57 27.43,61.72 28.19,61.72 X1.1 | X1.12 28.35,56.24 28.35,55.78 X1.13 28.35,55.63 28.35,55.32 X1.14 28.35,55.17 28.35,54.86 X1.15 28.35,54.71 28.35,54.41 X1.16 28.19,54.25 v23.32,54.25 | 27.28,60.5 20.57,60.5 16.15,56.08 S4.4 | T15.2 17.53,42.22 16.15,40.84 S6.4 16.15,37.8 19.66,34.29 19.66,32.92 20.42,32.16 22.4,32.16 | 28.35,48.77 28.35,49.23 X1.26 28.35,49.38 28.35,49.68 X1.25 | 28.35,48.77 28.35,48.31 X1.28 28.35,48.16 28.35,47.85 X1.29 28.35,47.7 28.35,47.4 X1.30 28.35,47.24 28.35,46.79 X1.31 28.35,46.63 28.35,46.33 X1.32 | 28.35,48.77 X1.27 | X1.34 28.35,45.41 28.35,45.72 X1.33 28.35,45.87 28.35,46.18 X1.32 | X1.32 28.19,46.18 25.15,46.18 T12.2 25.15,46.02 24.08,44.96 24.08,40.23 | 24.69,33.53 24.38,33.83 24.38,33.98 23.16,35.2 T13.2 | 24.69,33.53 25.6,33.53 26.82,34.75 v26.82,36.88 26.82,38.71 26.98,38.86 | 26.98,38.86 27.74,39.62 28.19,39.62 X1.45 | 24.08,40.23 25.6,40.23 26.98,38.86 | 24.08,40.23 23.16,40.23 T14.2 | 22.4,32.16 23.32,32.16 24.69,33.53 | 22.4,32.16 v22.4,30.63 20.27,28.5 20.27,26.06 26.98,19.36 v26.98,18.29 | v67.82,31.55 67.82,23.32 68.73,22.4 S1.4 68.89,22.4 70.56,24.08 73.91,24.08 75.59,22.4 78.94,22.4 S2.4 | v98.75,61.27 101.04,61.27 106.22,56.08 S3.4 106.22,55.93 106.22,51.66 102.56,48.01 102.56,46.33 IC4.2 102.56,46.18 102.56,42.98 106.22,39.32 S5.4 106.38,39.17 108.2,37.34 111.25,37.34 v113.23,39.32 | v50.75,10.36 52.27,11.89 v55.78,11.89
IO1_0  (via drill 0.38)
  Top 0.152: R28.1 72.54,27.43 72.54,25.3 72.69,25.15 C14.1 72.85,25.15 72.85,22.86 73.3,22.4 S1.2 | v51.51,20.73 51.51,23.62 52.58,24.69 52.58,26.06 51.97,26.67 51.97,26.98 53.03,28.04 55.47,28.04 IC5.31
  Bottom 0.152: v51.51,20.73 51.82,20.73 52.12,20.42 52.88,20.42 57,24.54 58.37,24.54 63.7,29.87 64.77,29.87 65.84,28.8 65.84,26.21 63.7,24.08 63.7,23.77 67.06,20.42 71.48,20.42 73.3,22.25 S1.2
IO1_1  (via drill 0.38)
  Top 0.152: R29.1 81.99,27.58 81.99,26.21 82.45,25.76 C15.1 82.6,25.6 82.6,23.32 83.52,22.4 S2.2 | v52.73,26.82 53.49,27.58 55.47,27.58 IC5.32 | v51.82,25.91 50.9,25.91 50.29,25.3 50.29,15.09 52.73,12.65 52.73,10.82 52.27,10.36 v51.82,10.36
  Bottom 0.152: v51.82,25.91 v52.73,26.82 | v51.82,10.36 71.32,10.36 83.21,22.25 83.52,22.25 S2.2
IO1_2  (via drill 0.38)
  Top 0.152: 102.26,52.43 102.26,54.86 102.56,55.17 C16.1 102.56,55.32 101.5,56.39 101.5,57.76 101.8,58.06 106.53,58.06 108.51,56.08 110.8,56.08 S3.2 | v53.8,26.82 55.47,26.82 IC5.33 | v48.01,33.22 48.01,33.68 v46.18,35.51 | 102.26,52.43 v103.17,51.51 | 102.26,52.43 R30.1
  Bottom 0.152: v53.8,26.82 53.8,27.43 v48.01,33.22 | v46.18,35.51 46.63,35.51 51.05,39.93 63.86,39.93 64.16,39.62 91.29,39.62 v103.17,51.51
IO1_3  (via drill 0.38)
  Top 0.152: 3.2,62.18 2.29,62.18 1.98,62.48 1.98,64.31 2.44,64.77 18.9,64.77 21.64,62.03 C17.1 21.64,61.87 20.73,60.96 20.73,56.08 S4.2 | 3.2,62.18 4.57,62.18 R31.1 | v53.34,25.45 54.1,26.21 55.47,26.21 IC5.34 | v21.03,26.21 18.75,26.21 v16.46,28.5 | 3.2,62.18 v3.2,62.03
  Bottom 0.152: v53.34,25.45 52.27,25.45 51.21,24.38 42.67,24.38 39.01,20.73 39.01,20.57 38.25,19.81 27.43,19.81 v21.03,26.21 | v16.46,28.5 16.46,31.7 7.01,41.15 7.01,54.41 3.05,58.37 3.05,61.87 v3.2,62.03
IO4_0  (via drill 0.38)
  Top 0.152: v78.94,33.83 78.79,33.98 63.4,33.98 IC5.17 63.25,33.98 62.33,33.98 v62.18,33.83 | v83.06,29.72 94.34,29.72 94.94,29.11 IC1.3 | v30.18,24.84 37.49,24.84 IC2.3 37.64,24.84 38.1,24.84 39.17,25.91 v39.17,28.04
  Bottom 0.152: v83.06,29.72 v78.94,33.83 | v30.18,24.84 28.19,26.82 28.19,37.34 29.41,38.56 29.41,39.17 30.79,40.54 30.79,41 30.33,41.45 30.33,52.43 28.96,53.8 28.35,53.8 X1.17 | v62.18,33.83 61.42,33.83 60.81,34.44 60.81,35.05 60.96,35.2 60.96,35.51 60.35,36.12 47.7,36.12 39.62,28.04 v39.17,28.04
IO4_1  (via drill 0.38)
  Top 0.152: v79.7,34.59 63.4,34.59 IC5.18 | v81.99,32.31 92.51,32.31 94.34,30.48 94.94,30.48 IC1.4 | v25.91,53.49 23.62,51.21 23.62,49.07 v33.38,39.32 | v35.51,27.58 37.03,26.06 37.49,26.06 IC2.4 | v39.17,32.31 v46.18,32.31
  Bottom 0.152: v81.99,32.31 v79.7,34.59 74.07,34.59 72.08,32.61 65.08,32.61 59.28,26.82 57.61,26.82 57.15,27.28 54.41,27.28 48.77,32.92 48.77,33.38 48.16,33.98 47.85,33.98 v46.18,32.31 | v25.91,53.49 26.06,53.34 28.19,53.34 X1.18 | v33.38,39.32 33.38,31.55 35.2,29.72 | 35.2,29.72 35.2,27.89 v35.51,27.58 | v39.17,32.31 37.8,32.31 35.2,29.72
IO4_2  (via drill 0.38)
  Top 0.152: IC1.7 94.94,34.29 94.34,34.29 92.51,36.12 83.67,36.12 83.52,36.27 83.52,37.03 83.82,37.34 85.95,37.34 86.26,37.64 86.26,38.41 86.11,38.56 83.67,38.56 80.47,35.36 63.4,35.36 IC5.19 63.25,35.36 v60.2,35.36 | v19.36,47.55 19.36,45.11 23.32,41.15 23.32,39.01 24.23,38.1 26.67,38.1 27.89,36.88 v29.57,36.88 | v33.83,30.18 37.19,30.18 37.49,29.87 IC2.7
  Bottom 0.152: v19.36,47.55 19.36,50.44 22.1,53.19 25.3,53.19 25.76,52.73 28.19,52.73 X1.19 | v29.57,36.88 29.57,34.44 v33.83,30.18 33.83,28.35 35.36,26.82 38.86,26.82 47.4,35.36 v60.2,35.36
IO4_3  (via drill 0.38)
  Top 0.152: 34.29,38.56 32.31,38.56 v30.02,40.84 | 34.29,38.56 34.9,38.56 36.73,40.39 44.04,40.39 49.07,35.36 55.47,35.36 IC5.20 55.63,35.36 v55.63,37.34 | v35.97,31.7 36.42,31.24 37.49,31.24 IC2.8 | 34.29,38.56 v34.29,38.71 | v86.41,33.53 96.01,33.53 96.32,33.83 96.32,34.59 95.56,35.36 94.94,35.36 IC1.8
  Bottom 0.152: v30.02,40.84 30.02,51.21 28.96,52.27 28.35,52.27 X1.20 | v35.97,31.7 35.97,37.03 v34.29,38.71 | v86.41,33.53 85.95,33.53 80.16,39.32 58.52,39.32 58.22,39.62 57.91,39.62 v55.63,37.34
IO4_4  (via drill 0.38)
  Top 0.152: v57.3,34.59 55.63,34.59 IC5.21 55.47,34.75 49.23,34.75 43.89,40.08 36.88,40.08 34.75,37.95 32,37.95 29.41,40.54 | v83.21,35.36 84.89,35.36 IC1.13 | v22.55,52.27 22.55,49.68 29.26,42.98 29.26,40.69 29.41,40.54 | v25.91,30.94 26.06,31.09 27.43,31.09 IC2.13 | v27.58,38.56 29.41,40.39 29.41,40.54
  Bottom 0.152: v57.3,34.59 60.2,34.59 61.72,33.07 72.08,33.07 74.37,35.36 v83.21,35.36 | v22.55,52.27 23.16,52.88 25.15,52.88 25.6,52.43 26.82,52.43 27.43,51.82 28.19,51.82 X1.21 | v25.91,30.94 25.91,33.38 27.58,35.05 v27.58,38.56
IO4_5  (via drill 0.38)
  Top 0.152: v36.42,38.71 37.49,39.78 42.82,39.78 48.46,34.14 55.47,34.14 IC5.22 | v32.16,41.76 32.16,43.74 v26.06,49.84
  Bottom 0.152: v36.42,38.71 35.2,38.71 v32.16,41.76 | v26.06,49.84 25.15,50.75 25.15,51.05 25.76,51.66 27.13,51.66 27.43,51.36 28.19,51.36 X1.22
IO4_6  (via drill 0.38)
  Top 0.152: v26.98,50.9 26.98,50.29 32.92,44.35 32.92,40.69 34.14,39.47 35.36,39.47 36.58,40.69 53.19,40.69 58.06,35.81 58.06,34.44 57,33.38 55.63,33.38 IC5.23
  Bottom 0.152: v26.98,50.9 27.43,50.9 27.58,50.75 28.19,50.75 X1.23
IO4_7  (via drill 0.38)
  Top 0.152: v34.44,40.54 35.2,41.3 56.54,41.3 58.83,39.01 58.83,34.75 56.84,32.77 55.63,32.77 IC5.24 | v31.7,46.48 31.7,47.09 27.13,51.66 26.67,51.66 v25.91,50.9
  Bottom 0.152: v34.44,40.54 33.98,41 33.83,41 31.7,43.13 v31.7,46.48 | v25.91,50.9 26.67,50.14 27.43,50.14 27.58,50.29 28.19,50.29 X1.24
J2_1
  Top 0.152: U$3.P$3 104.09,7.92 102.72,7.92 R12.1 102.56,8.08 94.34,8.08 92.81,9.6 K2.3
J2_3
  Top 0.152: K2.10 100.43,9.6 100.74,9.3 102.56,9.3 R12.2 102.72,9.3 104.09,10.67 104.09,17.98 U$3.P$4
J3_1
  Top 0.152: 24.38,9.14 26.21,9.14 26.67,9.6 K3.3 | 24.38,9.14 22.4,11.12 22.4,17.98 U$4.P$3 | 24.38,9.14 R27.1
J3_3
  Top 0.152: 24.38,7.77 22.4,7.77 U$4.P$4 | 24.38,7.77 32.46,7.77 34.29,9.6 K3.10 | 24.38,7.77 R27.2
LD_/C  (via drill 0.38)
  Top 0.152: v49.07,30.33 53.65,30.33 54.41,29.57 55.47,29.57 IC5.29 | v44.2,30.33 43.43,30.33 v42.22,31.55 | v29.57,57.15 v31.55,55.17
  Bottom 0.152: v44.2,30.33 v49.07,30.33 | v42.22,31.55 42.22,33.83 34.75,41.3 33.98,41.3 32.46,42.82 32.46,46.63 31.39,47.7 31.39,55.02 v31.55,55.17 | v29.57,57.15 28.96,57.76 28.35,57.76 X1.9
LEDK1
  Bottom 0.152: R37.2 24.84,44.35 26.98,44.35 27.58,43.74 28.19,43.74 X1.37
LEDK2
  Bottom 0.152: R38.2 24.84,43.28 28.19,43.28 X1.38
LEDK3
  Bottom 0.152: R39.2 26.67,41.91 27.43,42.67 28.19,42.67 X1.39
LEDK4  (via drill 0.38)
  Top 0.152: v26.06,41.15 v24.08,39.17
  Bottom 0.152: v24.08,39.17 24.69,38.56 24.69,36.88 R40.2 | v26.06,41.15 26.36,41.15 27.43,42.22 28.19,42.22 X1.40
LHVTRIG  (via drill 0.38)
  Top 0.152: v100.74,29.72 R13.1 | v57.61,25.3 v57.61,22.4 | v57,26.52 57,27.89 56.08,28.8 55.63,28.8 IC5.30
  Bottom 0.152: v100.74,29.72 88.7,29.72 76.66,17.68 65.84,17.68 64.16,16 59.44,16 57.61,17.83 v57.61,22.4 | v57.61,25.3 57.61,25.91 v57,26.52
LLED  (via drill 0.38)
  Top 0.152: v24.38,51.05 25.3,51.97 29.41,51.97 33.98,47.4 33.98,41.76 34.14,41.6 56.69,41.6 59.13,39.17 59.13,33.83 56.08,30.79 55.63,30.79 IC5.27
  Bottom 0.152: R44.1 20.42,46.48 21.49,46.48 R43.1 21.64,46.48 21.64,47.7 R41.1 23.62,49.53 23.62,50.9 24.08,51.36 | 24.08,51.36 24.69,51.97 R42.1 | 24.08,51.36 v24.38,51.05
LRD  (via drill 0.38)
  Top 0.152: v57.15,30.94 58.52,29.57 63.25,29.57 IC5.10 | v50.29,32.77 48.46,32.77 48.16,32.46 47.4,32.46 v40.84,39.01 | v29.57,56.08 v32.16,53.49
  Bottom 0.152: v57.15,30.94 52.12,30.94 v50.29,32.77 | v40.84,39.01 37.49,39.01 34.9,41.6 34.14,41.6 32.77,42.98 32.77,46.79 32.16,47.4 v32.16,53.49 | v29.57,56.08 28.96,56.69 28.35,56.69 X1.11
LRESET  (via drill 0.38)
  Top 0.152: v44.65,26.82 49.23,31.39 55.47,31.39 IC5.26
  Bottom 0.152: v44.65,26.82 38.71,20.88 38.71,20.73 38.1,20.12 35.81,20.12 28.5,27.43 28.5,37.19 29.72,38.41 29.72,39.01 31.09,40.39 31.09,45.26 30.63,45.72 30.63,54.25 30.33,54.56 30.33,57.45 29.11,58.67 28.35,58.67 X1.7
LTS+
  Top 0.152: K2.8 94.03,4.57 92.51,3.05 91.14,3.05 90.22,2.13 X4.1
LTS-
  Top 0.152: K2.5 92.66,4.57 92.66,5.64 90.22,8.08 X4.3
LVSEL
  Top 0.152: IC5.14 63.4,32 63.86,32 65.08,30.79 76.81,30.79 83.97,37.95 84.89,37.95 IC1.11
LWR  (via drill 0.38)
  Top 0.152: v59.44,28.8 63.25,28.8 IC5.9 | v54.25,28.8 53.34,28.8 48.62,24.08 46.79,24.08 v42.98,20.27
  Bottom 0.152: v59.44,28.8 58.98,28.8 58.06,27.89 55.17,27.89 v54.25,28.8 | v42.98,20.27 39.17,20.27 36.42,17.53 26.82,17.53 17.22,27.13 17.22,36.27 14.78,38.71 14.78,44.96 16.15,46.33 17.98,46.33 18.59,46.94 18.59,50.44 25.3,57.15 28.19,57.15 X1.10
N$1  (via drill 0.38)
  Top 0.152: v121.31,45.11 121.77,45.57 121.77,48.92 120.85,49.84 120.85,50.44 R1.1 | v96.62,28.96 95.56,27.89 94.94,27.89 IC1.2
  Bottom 0.152: v121.31,45.11 121.01,45.11 104.85,28.96 v96.62,28.96
N$2  (via drill 0.38)
  Top 0.152: v122.07,55.78 122.07,54.1 R2.1 | v96.62,32.77 95.56,31.7 94.94,31.7 IC1.5
  Bottom 0.152: v122.07,55.78 122.07,57.61 123.14,58.67 123.44,58.67 124.05,58.06 124.05,48.77 109.73,34.44 98.3,34.44 v96.62,32.77
N$3  (via drill 0.38)
  Top 0.152: v123.29,57.91 123.29,58.83 R3.1 | v97.08,34.14 95.86,32.92 94.94,32.92 IC1.6
  Bottom 0.152: v123.29,57.91 123.29,48.46 109.58,34.75 97.69,34.75 v97.08,34.14
N$4  (via drill 0.38)
  Top 0.152: v98.15,42.37 98.15,54.86 101.65,58.37 110.03,58.37 113.69,62.03 117.2,62.03 118.11,62.94 122.22,62.94 122.99,63.7 R4.1 | v96.62,37.03 95.25,37.03 94.94,36.73 IC1.9
  Bottom 0.152: v98.15,42.37 98.15,38.56 v96.62,37.03
N$5
  Top 0.152: R5.1 109.73,42.06 105.92,42.06 103.33,39.47 98.15,39.47 96.01,37.34 86.41,37.34 85.8,36.73 84.89,36.73 IC1.12
N$6
  Top 0.152: 100.58,62.18 97.54,62.18 T8.1 | 100.58,62.18 105.46,62.18 SG1.- | 100.58,62.18 L3.2
N$7
  Top 0.152: T4.3 117.2,63.25 121.31,63.25 121.77,63.7 R4.2
N$8
  Top 0.152: T5.3 116.43,42.82 115.82,42.82 115.21,42.22 111.25,42.22 R5.2
N$9
  Top 0.152: 121.01,29.72 D2.A | 121.01,29.72 121.77,30.48 U$1.4 121.01,29.72 | 121.01,29.72 121.01,19.96 124.36,16.61 124.36,7.92 U$3.P$1
N$10
  Top 0.152: T1.1 116.59,49.53 118.72,49.53 R7.1
N$11
  Top 0.152: T2.1 119.18,53.34 119.79,53.34 120.7,52.43 R8.1
N$12
  Top 0.152: T3.1 119.18,58.37 120.55,58.37 121.92,57 R9.1
N$13
  Top 0.152: T1.3 114.61,50.6 119.48,50.6 R1.2
N$14
  Top 0.152: T2.3 117.2,54.25 120.55,54.25 120.7,54.1 R2.2
N$15
  Top 0.152: T3.3 117.2,59.28 121.61,59.28 121.92,58.98 R3.2
N$16
  Top 0.152: T4.1 119.18,62.18 121.61,62.18 121.77,62.03 R10.1
N$17
  Top 0.152: IC7.7 120.4,41.3 120.4,44.35 R11.2 120.4,44.5 120.4,46.18 120.7,46.48 C1.2 120.85,46.48 120.85,48.77 R7.2 120.7,48.77 120.7,49.38 120.09,49.99 120.09,51.05 120.55,51.51 121.16,51.51 121.92,52.27 R8.2 122.07,52.43 122.07,52.88 123.29,54.1 123.29,56.84 R9.2 123.44,57 124.05,57.61 124.05,59.44 123.14,60.35 123.14,61.87 R10.2
N$18
  Top 0.152: C1.1 119.02,46.48 119.02,44.5 R11.1 118.87,44.35 118.87,44.04 116.43,41.6 114.61,41.6 112.47,39.47 112.47,37.49 113.69,36.27 C6.1 113.84,36.12 116.74,36.12 | D2.C 109.88,29.72 110.8,30.63 114.15,30.63 116.74,33.22 116.74,36.12 | 116.74,36.12 C5.1 116.89,36.12 119.18,36.12 IC7.1 119.33,35.97 119.33,35.36 120.09,34.59 123.9,34.59 125.27,33.22 125.27,27.74 124.51,26.98 124.51,18.14 U$3.P$2
N$19
  Top 0.152: 6.1,29.57 16,29.57 D1.A | 6.1,29.57 5.18,30.48 U$2.4 6.1,29.57 | 6.1,29.57 2.13,25.6 2.13,18.14 U$4.P$1
N$20  (via drill 0.38)
  Top 0.152: v1.98,37.8 0.91,38.86 0.91,53.95 2.9,55.93 4.72,55.93 6.4,57.61 13.11,57.61 13.72,57 R15.1 | v10.97,28.8 11.28,28.8 11.43,28.96 15.09,28.96 19.96,24.08 37.03,24.08 37.49,23.62 IC2.2
  Bottom 0.152: v10.97,28.8 v1.98,37.8
N$21
  Top 0.152: R13.2 107.44,29.72 108.66,30.94 112.78,30.94 114.45,32.61 U$1.1
N$22
  Top 0.152: T8.3 95.4,63.09 95.4,62.48 94.79,61.87 94.79,57.76 95.25,57.3 R14.2
N$23
  Top 0.152: S8.1 41.91,10.97 R35.1
N$24
  Top 0.152: R16.1 13.87,52.12 13.87,53.95 14.48,54.56 14.48,55.63 14.02,56.08 10.97,56.08 10.52,56.54 8.84,56.54 7.92,55.63 3.05,55.63 1.22,53.8 1.22,40.39 3.05,38.56 8.53,38.56 10.52,36.58 10.52,35.97 10.67,35.81 15.54,35.81 15.7,35.97 16.61,35.97 20.42,32.16 21.95,32.16 26.21,27.89 34.9,27.89 35.36,28.35 35.97,28.35 36.88,27.43 37.49,27.43 IC2.5
N$25  (via drill 0.38)
  Top 0.152: v19.36,41.15 17.98,42.52 17.98,44.65 17.83,44.81 17.07,44.81 14.48,47.4 14.17,47.4 R17.1 | v22.1,32.92 22.1,32.46 25.3,29.26 36.88,29.26 37.49,28.65 IC2.6
  Bottom 0.152: v19.36,41.15 19.36,37.8 21.79,35.36 21.79,33.22 v22.1,32.92
N$26
  Top 0.152: R18.1 15.54,43.43 16.46,42.52 16.61,42.52 19.36,39.78 19.36,39.32 21.18,37.49 21.95,37.49 26.36,33.07 28.5,33.07 29.11,32.46 37.49,32.46 IC2.9
N$27
  Top 0.152: R19.1 24.54,32.46 27.43,32.46 IC2.12
N$28
  Bottom 0.152: T13.3 23.01,33.38 23.01,34.14 22.1,35.05 22.1,39.17 21.79,39.47 21.79,43.59 20.42,44.96 R44.2
N$29
  Top 0.152: T6.3 7.92,57 12.5,57 R15.2
N$30
  Top 0.152: T7.3 7.92,51.82 12.34,51.82 12.5,51.97 R16.2
N$31
  Top 0.152: T9.3 7.92,46.79 12.19,46.79 12.8,47.4 R17.2
N$32
  Top 0.152: T10.3 9.14,41.76 10.82,41.76 12.5,43.43 R18.2
N$33
  Top 0.152: T11.3 20.57,36.58 23.16,33.98 23.16,32.61 R19.2
N$34
  Top 0.152: R35.2 40.39,10.97 39.01,10.97 36.27,13.72 27.58,13.72 26.67,14.63 K3.1
  Bottom 0.152: K3.1 26.67,14.33 30.33,10.67 49.07,10.67 50.14,9.6 71.02,9.6 75.13,13.72 83.67,13.72 84.58,14.63 92.66,14.63 K2.1
N$35
  Top 0.152: T6.1 9.91,55.78 11.89,55.78 12.5,55.17 R22.1
N$36
  Top 0.152: T7.1 9.91,50.75 12.04,50.75 12.5,50.29 R23.1
N$37
  Top 0.152: T9.1 9.91,45.87 12.8,45.87 R24.1
N$38
  Top 0.152: T10.1 11.28,40.54 13.72,40.54 R25.1
N$39
  Top 0.152: R26.2 2.29,44.2 4.27,44.2 4.57,43.89 C2.2 4.57,43.74 | 4.57,43.74 4.57,41.91 3.96,41.3 IC8.7 | R25.2 13.72,42.37 13.26,42.82 13.26,44.2 | 13.26,44.2 13.26,45.11 14.02,45.87 R24.2 14.02,46.02 13.41,46.63 13.41,48.01 13.72,48.31 13.72,50.29 | 13.72,50.29 13.26,50.75 13.26,53.8 13.72,54.25 13.72,55.02 R22.2 | 13.72,50.29 R23.2 | 4.57,43.74 11.73,43.74 12.19,44.2 13.26,44.2
N$40  (via drill 0.38)
  Top 0.152: C8.1 21.03,31.24 18.9,31.24 C7.1 18.75,31.24 18.14,31.85 16,31.85 D1.C 16,32 v14.02,32 | R26.1 2.29,45.72 4.57,45.72 C2.1 4.57,45.57 4.88,45.57 v5.94,44.5 | v5.49,37.8 3.96,37.8 2.74,36.58 2.74,36.12 IC8.1 2.59,35.97 1.22,34.59 1.22,17.37 1.98,16.61 1.98,7.92 U$4.P$2
  Bottom 0.152: 5.94,38.25 v5.94,44.5 | v5.49,37.8 5.94,38.25 | v14.02,32 12.19,32 5.94,38.25
N$41
  Bottom 0.152: T12.1 23.16,46.94 23.16,44.81 23.47,44.5 R37.1
N$42  (via drill 0.38)
  Top 0.152: v61.42,21.95 65.99,21.95 R21.2 | v56.54,17.07 v58.52,19.05 | v30.48,11.43 26.82,11.43 23.16,15.09 23.16,18.75 16.15,25.76 14.94,25.76 12.5,28.19 U$2.1
  Bottom 0.152: v58.52,19.05 v61.42,21.95 | v56.54,17.07 56.54,16.61 51.36,11.43 v30.48,11.43
N$43
  Bottom 0.152: T15.1 15.54,44.5 18.59,44.5 19.81,45.72 22.1,45.72 22.86,44.96 22.86,43.89 23.47,43.28 R38.1
N$44
  Bottom 0.152: T14.1 25.15,39.47 24.69,39.47 24.23,39.93 23.93,39.93 23.62,39.62 22.55,39.62 22.4,39.78 22.4,40.84 R39.1
N$45
  Top 0.152: T5.1 115.67,40.84 117.81,40.84 121.31,37.34 122.22,37.34 122.99,36.58 122.99,36.12 IC7.4
N$46
  Bottom 0.152: T13.1 25.15,35.2 23.62,36.73 R40.1
N$47
  Top 0.152: T11.1 10.06,34.59 7.92,34.59 6.55,35.97 IC8.4
N$48
  Bottom 0.152: T14.3 23.01,38.41 23.01,38.71 22.1,39.62 22.1,44.5 21.64,44.96 R43.2
N$49
  Bottom 0.152: T12.3 25.15,49.23 24.84,49.53 R41.2
N$50
  Bottom 0.152: T15.3 17.53,45.57 18.29,45.57 20.42,47.7 21.18,47.7 22.86,49.38 22.86,51.36 23.47,51.97 R42.2
RHVTRIG
  Top 0.152: R21.1 65.99,23.32 64.47,24.84 63.4,24.84 IC5.3
RTS+
  Top 0.152: K3.8 38.1,4.57 40.54,2.13 X5.1
RTS-
  Top 0.152: K3.5 32.92,4.57 35.81,7.47 39.93,7.47 40.54,8.08 X5.3
RVSEL
  Top 0.152: IC5.25 55.47,32 47.4,32 46.33,33.07 28.96,33.07 28.5,33.53 27.58,33.53 IC2.11
SCL  (via drill 0.38)
  Top 0.152: v61.57,31.39 63.25,31.39 IC5.13 | v53.49,29.57 53.19,29.57 v51.05,27.43 | v51.05,25.15 51.05,21.18 50.75,20.88 50.75,15.09 53.03,12.8 53.03,10.67 49.23,6.86 47.09,6.86 46.33,7.62 X2.2
  Bottom 0.152: v61.57,31.39 61.11,31.39 57.91,28.19 55.78,28.19 54.41,29.57 v53.49,29.57 | v51.05,25.15 v51.05,27.43 | X3.2 79.1,7.62 52.73,7.62 51.97,6.86 47.09,6.86 46.33,7.62 X2.2
SDA  (via drill 0.38)
  Top 0.152: v64.47,28.8 64.47,30.02 63.86,30.63 63.4,30.63 IC5.12 | 64.01,15.24 v64.01,16.76 | 64.01,15.24 57,8.23 v52.43,8.23 | v82.45,9.75 82.45,8.08 80.92,6.55 72.69,6.55 64.01,15.24
  Bottom 0.152: v64.47,28.8 64.47,28.35 63.4,27.28 63.4,23.62 64.01,23.01 v64.01,16.76 | v52.43,8.23 50.6,8.23 49.07,9.75 47.85,9.75 47.09,8.99 X2.3 | v82.45,9.75 81.23,9.75 80.47,8.99 80.01,8.99 X3.3
SPKR  (via drill 0.38)
  Top 0.152: v95.25,44.5 R14.1 | v64.31,40.39 59.44,35.51 59.44,32.61 61.87,30.18 63.25,30.18 IC5.11
  Bottom 0.152: v95.25,44.5 95.25,44.04 91.59,40.39 v64.31,40.39
TCK  (via drill 0.38)
  Top 0.152: v1.68,59.74 2.44,58.98 TP4.TP | v33.22,47.24 33.22,40.84 34.29,39.78 35.2,39.78 36.42,41 55.93,41 v58.06,38.86 | v80.01,38.56 83.21,38.56 86.26,41.6 98.3,41.6 100.74,44.04 103.33,44.04 104.85,45.57 C18.1 | R32.1 102.56,50.44 102.56,48.01 104.85,45.72 C18.1 | v57.76,28.96 57.76,26.36 57,25.6 55.63,25.6 IC5.35 | v61.27,32.46 61.27,34.29 v61.57,34.59 | v106.22,44.5 105,45.72 C18.1
  Bottom 0.152: v1.68,59.74 1.68,61.87 3.35,63.55 12.8,63.55 13.26,63.09 29.11,63.09 33.22,58.98 v33.22,47.24 | 61.57,38.86 79.7,38.86 v80.01,38.56 | 61.57,38.86 v58.06,38.86 | v61.27,32.46 v57.76,28.96 | 61.57,38.86 v61.57,34.59 | v106.22,44.5 110.8,39.93 110.8,39.32 S5.2
TDI
  Top 0.152: 53.34,23.16 52.58,22.4 S7.2 | 53.34,23.16 54.41,24.23 55.47,24.23 IC5.37 | 55.78,20.73 54.25,19.2 54.25,16 55.02,15.24 55.02,11.73 49.53,6.25 46.02,6.25 42.98,9.3 37.19,9.3 34.9,7.01 1.37,7.01 0.61,7.77 0.61,59.59 2.44,61.42 TP2.TP | R34.1 58.98,20.42 56.24,20.42 55.93,20.73 C20.1 55.78,20.73 | 55.78,20.73 53.34,23.16
TDO  (via drill 0.38)
  Top 0.152: v55.47,22.1 55.47,23.47 IC5.38 | v5.79,62.79 2.59,62.79 TP1.TP | R36.1 26.67,19.51 27.43,18.75 34.14,18.75 34.59,19.2 C21.1 34.59,19.36 v34.59,22.25 35.2,22.86 38.71,22.86 39.93,21.64 41.91,21.64 S8.3
  Bottom 0.152: v55.47,22.1 55.02,22.1 52.88,19.96 44.2,19.96 42.67,21.49 41.91,21.49 S8.3 | v5.79,62.79 28.96,62.79 30.79,60.96 30.79,54.56 30.94,54.41 30.94,45.87 31.39,45.41 31.39,40.23 30.02,38.86 30.02,38.25 28.8,37.03 28.8,28.04 v34.59,22.25
TEST  (via drill 0.38)
  Top 0.152: R20.1 4.72,57.15 3.96,56.39 TP6.TP 2.44,56.39 v1.83,55.78 | v63.25,22.86 63.25,23.47 IC5.1 | v58.37,17.98 56.69,16.31 v55.32,16.31
  Bottom 0.152: v58.37,17.98 v63.25,22.86 | v55.32,16.31 53.03,14.02 36.42,14.02 33.53,16.92 24.99,16.92 16.15,25.76 15.7,25.76 1.83,39.62 v1.83,55.78
TMS  (via drill 0.38)
  Top 0.152: v3.81,58.98 2.59,60.2 TP3.TP | v17.83,47.09 17.83,46.48 18.29,46.02 R33.1 18.44,45.87 18.9,45.41 18.9,43.74 C19.1 19.05,43.59 19.05,42.37 20.57,40.84 S6.2 | v53.19,24.38 53.65,24.84 55.47,24.84 IC5.36 | v45.41,23.62 38.86,30.18 38.86,30.33 38.71,30.48 34.44,30.48 33.22,31.7 24.08,31.7 23.93,31.85 23.93,34.14 v21.34,36.73
  Bottom 0.152: v3.81,58.98 3.81,58.06 14.78,47.09 v17.83,47.09 | v53.19,24.38 51.66,24.38 51.36,24.08 45.87,24.08 v45.41,23.62 | v21.34,36.73 21.34,40.08 20.73,40.69 S6.2
VBAT
  Top 0.152: R46.2 57.76,13.87 R45.1 57.91,14.02 57.91,14.48 59.74,16.31 59.74,20.88 58.37,22.25 58.37,27.74 58.52,27.89 58.52,29.11 57.61,30.02 55.63,30.02 IC5.28
VCC  (via drill 0.38)
  Top 0.152: 45.41,10.21 45.41,8.99 X2.1 | 45.41,10.21 45.41,11.43 R6.2 | v13.41,63.86 16.61,63.86 IC3.3 | 45.41,10.21 41.3,10.21 41.15,10.36 41.15,11.43 37.95,14.63 34.29,14.63 K3.12 | L3.1 100.58,59.89 109.58,59.89 111.86,62.18 SG1.+ | K2.12 98.45,16.61 98.45,26.67 C10.1
  Bottom 0.152: K3.7 34.29,2.13 37.19,2.13 43.89,8.84 45.26,8.84 X2.1 45.41,8.99 45.87,8.99 46.94,10.06 49.23,10.06 50.29,8.99 78.33,8.99 X3.1 78.49,8.99 78.79,8.99 83.21,13.41 99.06,13.41 | v13.41,63.86 3.2,63.86 0.91,61.57 0.91,37.95 23.16,15.7 33.38,15.7 34.29,14.78 K3.12 | 99.06,13.41 100.28,14.63 K2.12 100.43,14.78 100.43,15.85 124.36,39.78 124.36,58.22 120.4,62.18 112.01,62.18 SG1.+ | 99.06,13.41 99.06,4.42 100.28,3.2 100.28,2.13 K2.7
XIN
  Top 0.152: IC5.6 63.4,26.98 65.99,26.98 Q3.2 66.14,27.13 66.14,29.72 C12.1
XOUT
  Top 0.152: IC5.5 63.4,26.21 65.23,26.21 65.99,25.45 Q3.1 66.14,25.45 66.29,25.6 68.58,25.6 C11.1
(copper drawn outside any net)
  shapes: Bottom area x1, Top area x1